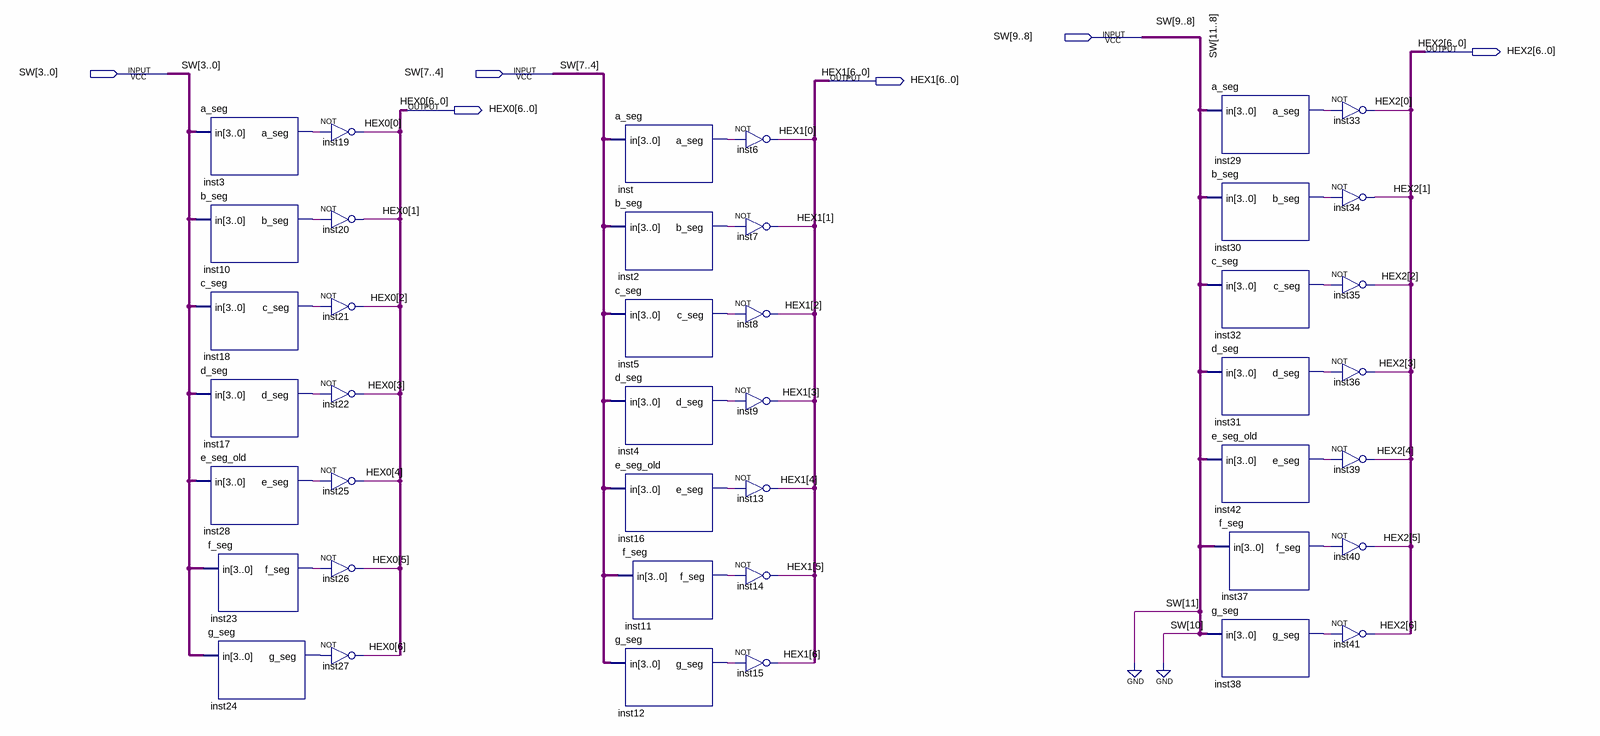
[diagram p0: schematic sheet]
// Quartus schematic bcd_seven_seg.bdf as structural Verilog: 42 symbols, 6 pins
module bcd_seven_seg (
  input  [9:0] SW,
  output [6:0] HEX2,
  output [6:0] HEX1,
  output [6:0] HEX0
);

  wire inst2_b_seg, inst3_a_seg, inst4_d_seg, inst5_c_seg, inst10_b_seg, inst11_f_seg, inst12_g_seg,
       inst16_e_seg, inst17_d_seg, inst18_c_seg, inst23_f_seg, inst24_g_seg, inst28_e_seg, inst29_a_seg,
       inst30_b_seg, inst31_d_seg, inst32_c_seg, inst37_f_seg, inst38_g_seg, inst42_e_seg, inst_a_seg;

  a_seg inst3 (.in(SW[3:0]), .a_seg(inst3_a_seg));
  b_seg inst10 (.in(SW[3:0]), .b_seg(inst10_b_seg));
  c_seg inst18 (.in(SW[3:0]), .c_seg(inst18_c_seg));
  d_seg inst17 (.in(SW[3:0]), .d_seg(inst17_d_seg));
  e_seg_old inst28 (.in(SW[3:0]), .e_seg(inst28_e_seg));
  f_seg inst23 (.in(SW[3:0]), .f_seg(inst23_f_seg));
  g_seg inst24 (.in(SW[3:0]), .g_seg(inst24_g_seg));
  not inst19 (HEX0[0], inst3_a_seg);
  not inst20 (HEX0[1], inst10_b_seg);
  not inst21 (HEX0[2], inst18_c_seg);
  not inst22 (HEX0[3], inst17_d_seg);
  not inst25 (HEX0[4], inst28_e_seg);
  not inst26 (HEX0[5], inst23_f_seg);
  not inst27 (HEX0[6], inst24_g_seg);
  a_seg inst (.in(SW[7:4]), .a_seg(inst_a_seg));
  b_seg inst2 (.in(SW[7:4]), .b_seg(inst2_b_seg));
  c_seg inst5 (.in(SW[7:4]), .c_seg(inst5_c_seg));
  d_seg inst4 (.in(SW[7:4]), .d_seg(inst4_d_seg));
  e_seg_old inst16 (.in(SW[7:4]), .e_seg(inst16_e_seg));
  f_seg inst11 (.in(SW[7:4]), .f_seg(inst11_f_seg));
  g_seg inst12 (.in(SW[7:4]), .g_seg(inst12_g_seg));
  not inst6 (HEX1[0], inst_a_seg);
  not inst7 (HEX1[1], inst2_b_seg);
  not inst8 (HEX1[2], inst5_c_seg);
  not inst9 (HEX1[3], inst4_d_seg);
  not inst13 (HEX1[4], inst16_e_seg);
  not inst14 (HEX1[5], inst11_f_seg);
  not inst15 (HEX1[6], inst12_g_seg);
  a_seg inst29 (.in({2'b00, SW[9:8]}), .a_seg(inst29_a_seg));
  b_seg inst30 (.in({2'b00, SW[9:8]}), .b_seg(inst30_b_seg));
  c_seg inst32 (.in({2'b00, SW[9:8]}), .c_seg(inst32_c_seg));
  d_seg inst31 (.in({2'b00, SW[9:8]}), .d_seg(inst31_d_seg));
  e_seg_old inst42 (.in({2'b00, SW[9:8]}), .e_seg(inst42_e_seg));
  f_seg inst37 (.in({2'b00, SW[9:8]}), .f_seg(inst37_f_seg));
  g_seg inst38 (.in({2'b00, SW[9:8]}), .g_seg(inst38_g_seg));
  not inst33 (HEX2[0], inst29_a_seg);
  not inst34 (HEX2[1], inst30_b_seg);
  not inst35 (HEX2[2], inst32_c_seg);
  not inst36 (HEX2[3], inst31_d_seg);
  not inst39 (HEX2[4], inst42_e_seg);
  not inst40 (HEX2[5], inst37_f_seg);
  not inst41 (HEX2[6], inst38_g_seg);
endmodule
